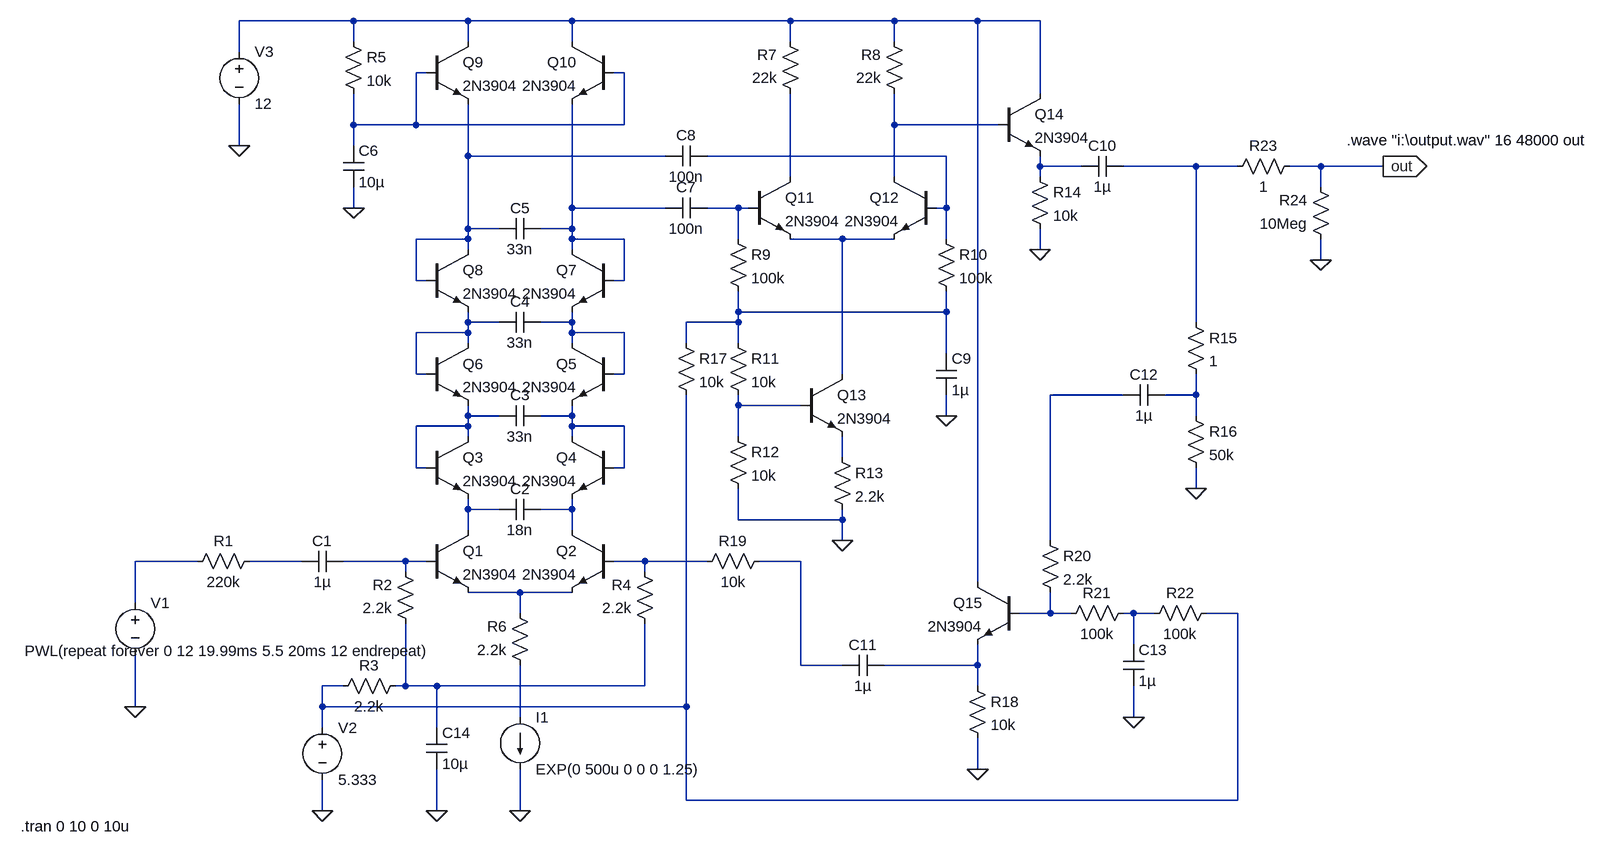
[diagram p0: schematic 303vcf.asc]
303vcf.asc, the LTspice schematic file:
Version 4
SHEET 1 2316 680
WIRE 384 -752 208 -752
WIRE 560 -752 384 -752
WIRE 720 -752 560 -752
WIRE 1056 -752 720 -752
WIRE 1216 -752 1056 -752
WIRE 1344 -752 1216 -752
WIRE 1440 -752 1344 -752
WIRE 384 -720 384 -752
WIRE 560 -720 560 -752
WIRE 720 -720 720 -752
WIRE 1056 -720 1056 -752
WIRE 1216 -720 1216 -752
WIRE 208 -704 208 -752
WIRE 496 -672 480 -672
WIRE 800 -672 784 -672
WIRE 1440 -640 1440 -752
WIRE 384 -592 384 -640
WIRE 480 -592 480 -672
WIRE 480 -592 384 -592
WIRE 800 -592 800 -672
WIRE 800 -592 480 -592
WIRE 1216 -592 1216 -640
WIRE 1376 -592 1216 -592
WIRE 208 -560 208 -624
WIRE 384 -560 384 -592
WIRE 560 -544 560 -624
WIRE 864 -544 560 -544
WIRE 1296 -544 928 -544
WIRE 1440 -528 1440 -544
WIRE 1504 -528 1440 -528
WIRE 1680 -528 1568 -528
WIRE 1744 -528 1680 -528
WIRE 1872 -528 1824 -528
WIRE 1968 -528 1872 -528
WIRE 1056 -512 1056 -640
WIRE 1216 -512 1216 -592
WIRE 1440 -512 1440 -528
WIRE 1872 -496 1872 -528
WIRE 384 -464 384 -496
WIRE 720 -464 720 -624
WIRE 864 -464 720 -464
WIRE 976 -464 928 -464
WIRE 992 -464 976 -464
WIRE 1296 -464 1296 -544
WIRE 1296 -464 1280 -464
WIRE 560 -432 560 -544
WIRE 608 -432 560 -432
WIRE 720 -432 720 -464
WIRE 720 -432 672 -432
WIRE 560 -416 560 -432
WIRE 560 -416 480 -416
WIRE 720 -416 720 -432
WIRE 800 -416 720 -416
WIRE 976 -416 976 -464
WIRE 1136 -416 1056 -416
WIRE 1216 -416 1136 -416
WIRE 1296 -416 1296 -464
WIRE 560 -400 560 -416
WIRE 720 -400 720 -416
WIRE 1440 -400 1440 -432
WIRE 1872 -384 1872 -416
WIRE 480 -352 480 -416
WIRE 496 -352 480 -352
WIRE 800 -352 800 -416
WIRE 800 -352 784 -352
WIRE 976 -304 976 -336
WIRE 1296 -304 1296 -336
WIRE 1296 -304 976 -304
WIRE 560 -288 560 -304
WIRE 608 -288 560 -288
WIRE 720 -288 720 -304
WIRE 720 -288 672 -288
WIRE 976 -288 976 -304
WIRE 976 -288 896 -288
WIRE 1680 -288 1680 -528
WIRE 560 -272 560 -288
WIRE 560 -272 480 -272
WIRE 720 -272 720 -288
WIRE 800 -272 720 -272
WIRE 560 -256 560 -272
WIRE 720 -256 720 -272
WIRE 896 -256 896 -288
WIRE 976 -256 976 -288
WIRE 1296 -240 1296 -304
WIRE 480 -208 480 -272
WIRE 496 -208 480 -208
WIRE 800 -208 800 -272
WIRE 800 -208 784 -208
WIRE 1136 -208 1136 -416
WIRE 1568 -176 1456 -176
WIRE 1680 -176 1680 -208
WIRE 1680 -176 1632 -176
WIRE 976 -160 976 -176
WIRE 1072 -160 976 -160
WIRE 560 -144 560 -160
WIRE 608 -144 560 -144
WIRE 720 -144 720 -160
WIRE 720 -144 672 -144
WIRE 1296 -144 1296 -176
WIRE 1680 -144 1680 -176
WIRE 560 -128 560 -144
WIRE 560 -128 480 -128
WIRE 720 -128 720 -144
WIRE 800 -128 720 -128
WIRE 560 -112 560 -128
WIRE 720 -112 720 -128
WIRE 976 -112 976 -160
WIRE 1136 -80 1136 -112
WIRE 480 -64 480 -128
WIRE 496 -64 480 -64
WIRE 800 -64 800 -128
WIRE 800 -64 784 -64
WIRE 1680 -32 1680 -64
WIRE 560 0 560 -16
WIRE 608 0 560 0
WIRE 720 0 720 -16
WIRE 720 0 672 0
WIRE 976 16 976 -32
WIRE 1136 16 1136 0
WIRE 1136 16 976 16
WIRE 560 32 560 0
WIRE 720 32 720 0
WIRE 1136 48 1136 16
WIRE 1456 48 1456 -176
WIRE 144 80 48 80
WIRE 304 80 224 80
WIRE 464 80 368 80
WIRE 496 80 464 80
WIRE 832 80 784 80
WIRE 928 80 832 80
WIRE 1072 80 1008 80
WIRE 464 96 464 80
WIRE 832 96 832 80
WIRE 1344 112 1344 -752
WIRE 640 128 560 128
WIRE 720 128 640 128
WIRE 48 144 48 80
WIRE 640 160 640 128
WIRE 1456 160 1456 128
WIRE 1456 160 1408 160
WIRE 1488 160 1456 160
WIRE 1584 160 1568 160
WIRE 1616 160 1584 160
WIRE 1744 160 1696 160
WIRE 1584 208 1584 160
WIRE 1072 240 1072 80
WIRE 1136 240 1072 240
WIRE 1344 240 1344 208
WIRE 1344 240 1200 240
WIRE 368 272 336 272
WIRE 464 272 464 176
WIRE 464 272 448 272
WIRE 512 272 464 272
WIRE 832 272 832 176
WIRE 832 272 512 272
WIRE 1344 272 1344 240
WIRE 48 304 48 224
WIRE 336 304 336 272
WIRE 896 304 896 -176
WIRE 896 304 336 304
WIRE 640 320 640 240
WIRE 1584 320 1584 272
WIRE 336 336 336 304
WIRE 512 336 512 272
WIRE 1344 400 1344 352
WIRE 896 448 896 304
WIRE 1744 448 1744 160
WIRE 1744 448 896 448
WIRE 336 464 336 416
WIRE 512 464 512 400
WIRE 640 464 640 400
FLAG 48 304 0
FLAG 336 464 0
FLAG 640 464 0
FLAG 384 -464 0
FLAG 1296 -144 0
FLAG 1136 48 0
FLAG 1440 -400 0
FLAG 1680 -32 0
FLAG 208 -560 0
FLAG 1344 400 0
FLAG 1968 -528 out
IOPIN 1968 -528 Out
FLAG 1584 320 0
FLAG 512 464 0
FLAG 1872 -384 0
SYMBOL voltage 48 128 R0
WINDOW 3 -170 90 Left 2
SYMATTR Value PWL(repeat forever 0 12 19.99ms 5.5 20ms 12 endrepeat)
SYMATTR InstName V1
SYMBOL res 240 64 R90
WINDOW 0 0 56 VBottom 2
WINDOW 3 32 56 VTop 2
SYMATTR InstName R1
SYMATTR Value 220k
SYMBOL res 480 192 R180
WINDOW 0 36 76 Left 2
WINDOW 3 36 40 Left 2
SYMATTR InstName R2
SYMATTR Value 2.2k
SYMBOL res 352 288 R270
WINDOW 0 32 56 VTop 2
WINDOW 3 0 56 VBottom 2
SYMATTR InstName R3
SYMATTR Value 2.2k
SYMBOL cap 368 64 R90
WINDOW 0 0 32 VBottom 2
WINDOW 3 32 32 VTop 2
SYMATTR InstName C1
SYMATTR Value 1µ
SYMBOL voltage 336 320 R0
WINDOW 123 0 0 Left 2
WINDOW 39 0 0 Left 2
SYMATTR InstName V2
SYMATTR Value 5.333
SYMBOL npn 496 32 R0
SYMATTR InstName Q1
SYMATTR Value 2N3904
SYMBOL npn 784 32 M0
SYMATTR InstName Q2
SYMATTR Value 2N3904
SYMBOL res 848 192 R180
WINDOW 0 36 76 Left 2
WINDOW 3 36 40 Left 2
SYMATTR InstName R4
SYMATTR Value 2.2k
SYMBOL current 640 320 R0
WINDOW 123 0 0 Left 2
WINDOW 39 0 0 Left 2
SYMATTR InstName I1
SYMATTR Value EXP(0 500u 0 0 0 1.25)
SYMBOL npn 496 -112 R0
SYMATTR InstName Q3
SYMATTR Value 2N3904
SYMBOL npn 784 -112 M0
SYMATTR InstName Q4
SYMATTR Value 2N3904
SYMBOL npn 784 -256 M0
SYMATTR InstName Q5
SYMATTR Value 2N3904
SYMBOL npn 496 -256 R0
SYMATTR InstName Q6
SYMATTR Value 2N3904
SYMBOL npn 784 -400 M0
SYMATTR InstName Q7
SYMATTR Value 2N3904
SYMBOL npn 496 -400 R0
SYMATTR InstName Q8
SYMATTR Value 2N3904
SYMBOL npn 496 -720 R0
SYMATTR InstName Q9
SYMATTR Value 2N3904
SYMBOL npn 784 -720 M0
SYMATTR InstName Q10
SYMATTR Value 2N3904
SYMBOL cap 672 -16 R90
WINDOW 0 0 32 VBottom 2
WINDOW 3 32 32 VTop 2
SYMATTR InstName C2
SYMATTR Value 18n
SYMBOL cap 672 -160 R90
WINDOW 0 0 32 VBottom 2
WINDOW 3 32 32 VTop 2
SYMATTR InstName C3
SYMATTR Value 33n
SYMBOL cap 672 -304 R90
WINDOW 0 0 32 VBottom 2
WINDOW 3 32 32 VTop 2
SYMATTR InstName C4
SYMATTR Value 33n
SYMBOL cap 672 -448 R90
WINDOW 0 0 32 VBottom 2
WINDOW 3 32 32 VTop 2
SYMATTR InstName C5
SYMATTR Value 33n
SYMBOL res 368 -736 R0
SYMATTR InstName R5
SYMATTR Value 10k
SYMBOL cap 368 -560 R0
SYMATTR InstName C6
SYMATTR Value 10µ
SYMBOL res 656 256 R180
WINDOW 0 36 76 Left 2
WINDOW 3 36 40 Left 2
SYMATTR InstName R6
SYMATTR Value 2.2k
SYMBOL npn 992 -512 R0
SYMATTR InstName Q11
SYMATTR Value 2N3904
SYMBOL npn 1280 -512 M0
SYMATTR InstName Q12
SYMATTR Value 2N3904
SYMBOL res 1072 -624 R180
WINDOW 0 36 76 Left 2
WINDOW 3 36 40 Left 2
SYMATTR InstName R7
SYMATTR Value 22k
SYMBOL res 1232 -624 R180
WINDOW 0 36 76 Left 2
WINDOW 3 36 40 Left 2
SYMATTR InstName R8
SYMATTR Value 22k
SYMBOL cap 928 -480 R90
WINDOW 0 0 32 VBottom 2
WINDOW 3 32 32 VTop 2
SYMATTR InstName C7
SYMATTR Value 100n
SYMBOL cap 928 -560 R90
WINDOW 0 0 32 VBottom 2
WINDOW 3 32 32 VTop 2
SYMATTR InstName C8
SYMATTR Value 100n
SYMBOL res 960 -432 R0
SYMATTR InstName R9
SYMATTR Value 100k
SYMBOL res 1280 -432 R0
SYMATTR InstName R10
SYMATTR Value 100k
SYMBOL npn 1072 -208 R0
SYMATTR InstName Q13
SYMATTR Value 2N3904
SYMBOL res 960 -272 R0
SYMATTR InstName R11
SYMATTR Value 10k
SYMBOL res 960 -128 R0
SYMATTR InstName R12
SYMATTR Value 10k
SYMBOL res 1120 -96 R0
SYMATTR InstName R13
SYMATTR Value 2.2k
SYMBOL cap 1280 -240 R0
SYMATTR InstName C9
SYMATTR Value 1µ
SYMBOL npn 1376 -640 R0
SYMATTR InstName Q14
SYMATTR Value 2N3904
SYMBOL res 1424 -528 R0
SYMATTR InstName R14
SYMATTR Value 10k
SYMBOL cap 1568 -544 R90
WINDOW 0 0 32 VBottom 2
WINDOW 3 32 32 VTop 2
SYMATTR InstName C10
SYMATTR Value 1µ
SYMBOL res 1664 -304 R0
SYMATTR InstName R15
SYMATTR Value 1
SYMBOL res 1664 -160 R0
SYMATTR InstName R16
SYMATTR Value 50k
SYMBOL voltage 208 -720 R0
WINDOW 123 0 0 Left 2
WINDOW 39 0 0 Left 2
SYMATTR InstName V3
SYMATTR Value 12
SYMBOL res 880 -272 R0
SYMATTR InstName R17
SYMATTR Value 10k
SYMBOL npn 1408 112 M0
SYMATTR InstName Q15
SYMATTR Value 2N3904
SYMBOL res 1328 256 R0
SYMATTR InstName R18
SYMATTR Value 10k
SYMBOL res 1024 64 R90
WINDOW 0 0 56 VBottom 2
WINDOW 3 32 56 VTop 2
SYMATTR InstName R19
SYMATTR Value 10k
SYMBOL cap 1200 224 R90
WINDOW 0 0 32 VBottom 2
WINDOW 3 32 32 VTop 2
SYMATTR InstName C11
SYMATTR Value 1µ
SYMBOL cap 1632 -192 R90
WINDOW 0 0 32 VBottom 2
WINDOW 3 32 32 VTop 2
SYMATTR InstName C12
SYMATTR Value 1µ
SYMBOL res 1440 32 R0
SYMATTR InstName R20
SYMATTR Value 2.2k
SYMBOL res 1584 144 R90
WINDOW 0 0 56 VBottom 2
WINDOW 3 32 56 VTop 2
SYMATTR InstName R21
SYMATTR Value 100k
SYMBOL res 1712 144 R90
WINDOW 0 0 56 VBottom 2
WINDOW 3 32 56 VTop 2
SYMATTR InstName R22
SYMATTR Value 100k
SYMBOL cap 1568 208 R0
SYMATTR InstName C13
SYMATTR Value 1µ
SYMBOL cap 496 336 R0
SYMATTR InstName C14
SYMATTR Value 10µ
SYMBOL res 1840 -544 R90
WINDOW 0 0 56 VBottom 2
WINDOW 3 32 56 VTop 2
SYMATTR InstName R23
SYMATTR Value 1
SYMBOL res 1888 -400 R180
WINDOW 0 36 76 Left 2
WINDOW 3 36 40 Left 2
SYMATTR InstName R24
SYMATTR Value 10Meg
TEXT -128 488 Left 2 !.tran 0 10 0 10u
TEXT 1912 -568 Left 2 !.wave "i:\\output.wav" 16 48000 out

The netlist it stands for:
* 303vcf.asc
V1 N023 0 PWL(repeat forever 0 12 19.99ms 5.5 20ms 12 endrepeat)
R1 N024 N023 220k
R2 N033 N025 2.2k
R3 N031 N033 2.2k
C1 N025 N024 1µ
V2 N031 0 5.333
Q1 N021 N025 N028 0 2N3904
Q2 N022 N026 N028 0 2N3904
R4 N033 N026 2.2k
I1 N034 0 EXP(0 500u 0 0 0 1.25)
Q3 N018 N018 N021 0 2N3904
Q4 N019 N019 N022 0 2N3904
Q5 N014 N014 N019 0 2N3904
Q6 N013 N013 N018 0 2N3904
Q7 N009 N009 N014 0 2N3904
Q8 N004 N004 N013 0 2N3904
Q9 N001 N002 N004 0 2N3904
Q10 N001 N002 N009 0 2N3904
C2 N022 N021 18n
C3 N019 N018 33n
C4 N014 N013 33n
C5 N009 N004 33n
R5 N001 N002 10k
C6 N002 0 10µ
R6 N034 N028 2.2k
Q11 N008 N010 N011 0 2N3904
Q12 N003 N005 N011 0 2N3904
R7 N008 N001 22k
R8 N003 N001 22k
C7 N010 N009 100n
C8 N005 N004 100n
R9 N010 N012 100k
R10 N005 N012 100k
Q13 N011 N017 N020 0 2N3904
R11 N012 N017 10k
R12 N017 0 10k
R13 N020 0 2.2k
C9 N012 0 1µ
Q14 N001 N003 N006 0 2N3904
R14 N006 0 10k
C10 N007 N006 1µ
R15 N007 N016 1
R16 N016 0 50k
V3 N001 0 12
R17 N012 N031 10k
Q15 N001 N029 N032 0 2N3904
R18 N032 0 10k
R19 N027 N026 10k
C11 N032 N027 1µ
C12 N016 N015 1µ
R20 N015 N029 2.2k
R21 N030 N029 100k
R22 N031 N030 100k
C13 N030 0 1µ
C14 N033 0 10µ
R23 out N007 1
R24 0 out 10Meg
.model NPN NPN
.model PNP PNP
.lib standard.bjt
.tran 0 10 0 10u
.wave "i:\output.wav" 16 48000 out
.backanno
.end